# EAGLE design SOIC28-TSSOP28 v1.0 (EAGLE 7.2.0)
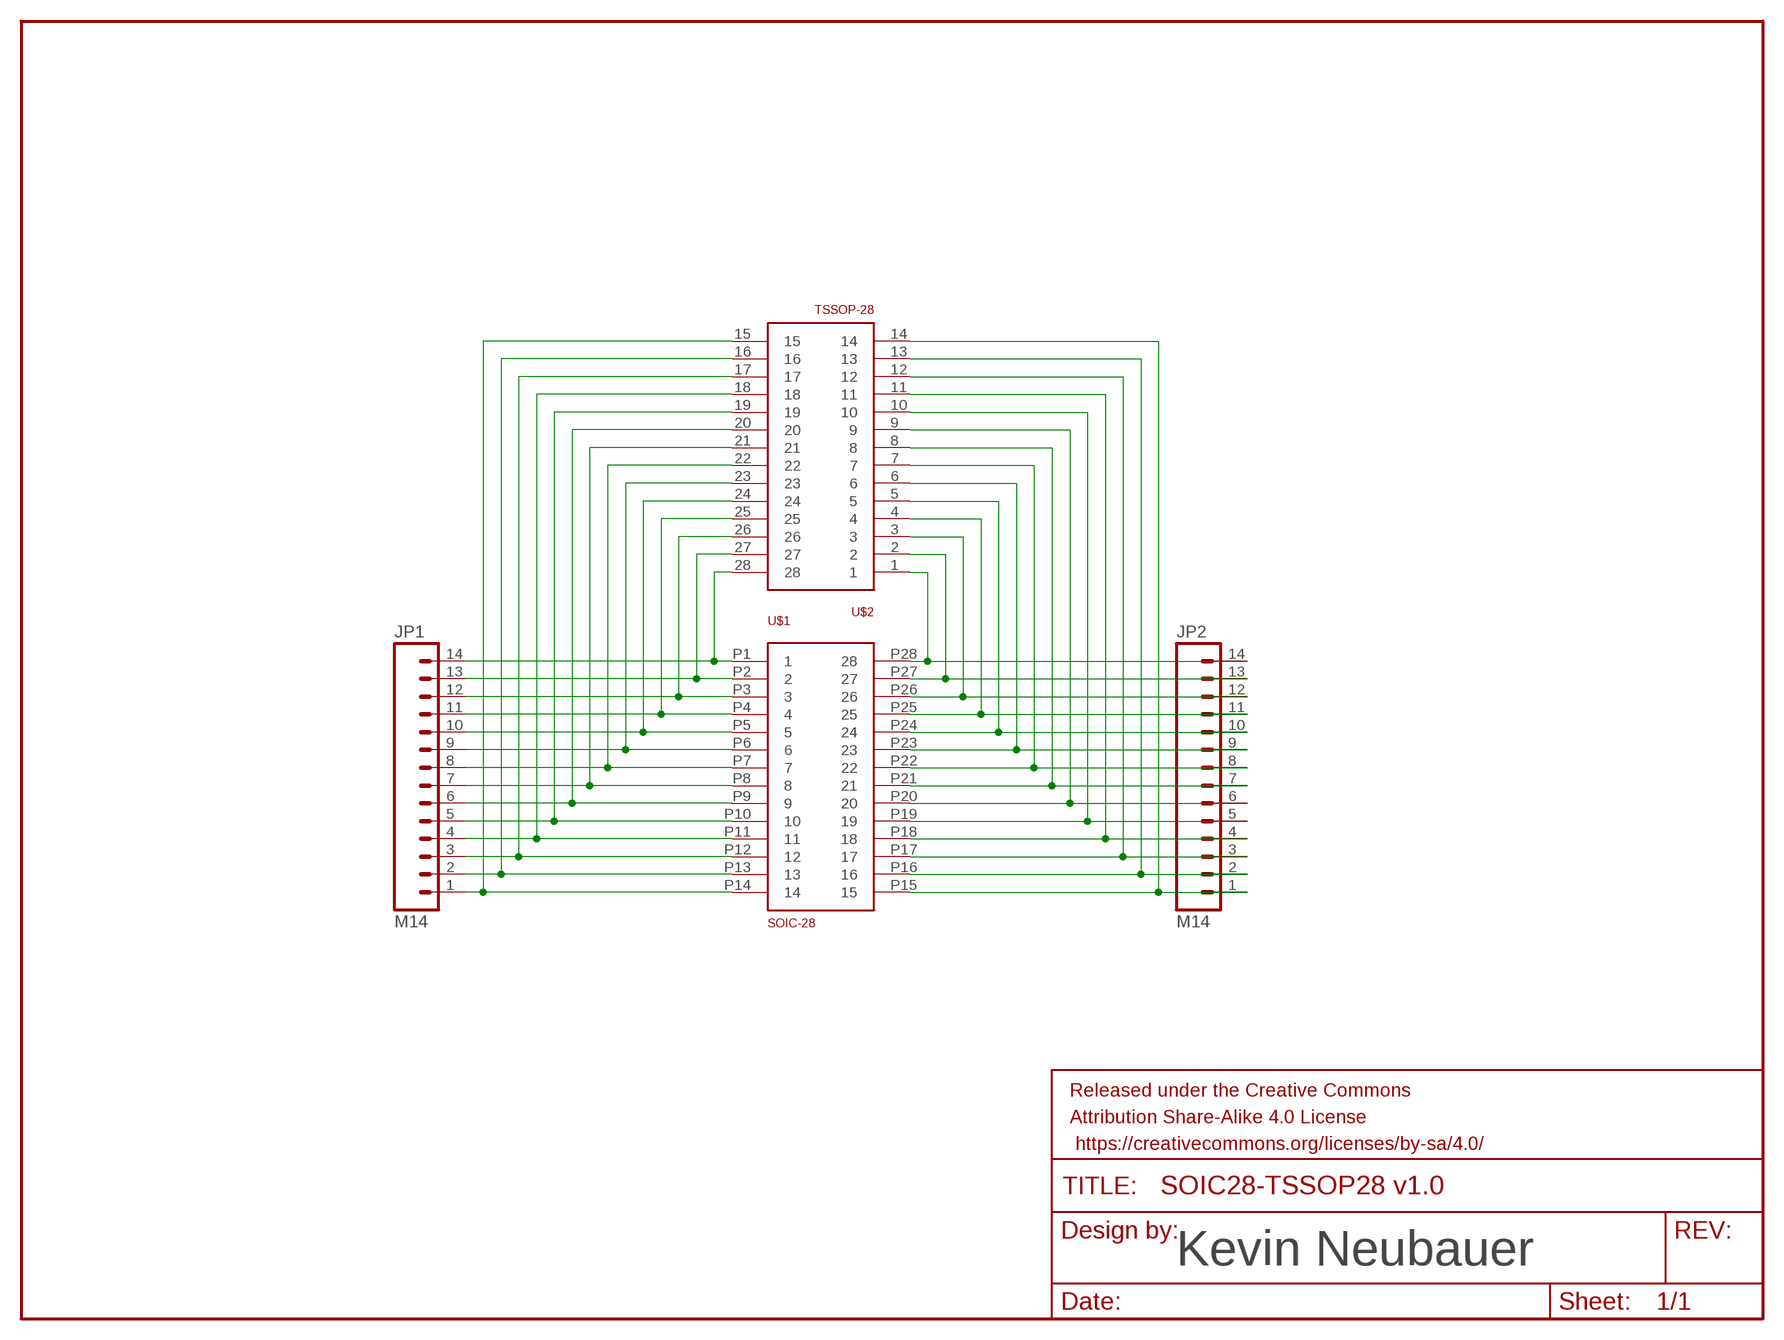
[diagram p0: schematic, sheet 1]

## Parts
FRAME1  FRAME-LETTER  [CREATIVE_COMMONS]
JP1  M14  [1X14]
JP2  M14  [1X14]
U$1  SOIC-28  [SOIC-28]
U$2  TSSOP-28  [TSSOP28]

## Nets
N$1: JP1.14 U$1.P1 U$2.28
N$2: JP1.13 U$1.P2 U$2.27
N$11: JP2.14 U$1.P28 U$2.1
N$12: JP2.13 U$1.P27 U$2.2
N$13: JP2.12 U$1.P26 U$2.3
N$14: JP2.11 U$1.P25 U$2.4
N$15: JP2.10 U$1.P24 U$2.5
N$16: JP2.9 U$1.P23 U$2.6
N$17: JP2.8 U$1.P22 U$2.7
N$18: JP2.7 U$1.P21 U$2.8
N$19: JP2.6 U$1.P20 U$2.9
N$20: JP2.5 U$1.P19 U$2.10
N$39: JP1.2 U$1.P13 U$2.16
N$40: JP1.1 U$1.P14 U$2.15
N$41: JP2.4 U$1.P18 U$2.11
N$42: JP2.3 U$1.P17 U$2.12
N$43: JP2.2 U$1.P16 U$2.13
N$44: JP2.1 U$1.P15 U$2.14
N$45: JP1.3 U$1.P12 U$2.17
N$46: JP1.4 U$1.P11 U$2.18
N$47: JP1.5 U$1.P10 U$2.19
N$48: JP1.6 U$1.P9 U$2.20
N$49: JP1.8 U$1.P7 U$2.22
N$50: JP1.7 U$1.P8 U$2.21
N$51: JP1.10 U$1.P5 U$2.24
N$52: JP1.9 U$1.P6 U$2.23
N$53: JP1.12 U$1.P3 U$2.26
N$54: JP1.11 U$1.P4 U$2.25

## Notes on the sheet
- Kevin Neubauer

## Library data of the parts
FRAME1 = SparkFun-Aesthetics:FRAME-LETTER: Schematic Frame Standard 8.5x11 US Letter frame
JP1 JP2 = SparkFun-Connectors:M14: Header 14 Standard 14-pin 0.1" header. Use with straight break away headers (SKU : PRT-00116), right angle break away headers (PRT-00553), swiss pins (PRT-00743), machine pins (PRT-00117), and female headers (PRT-00115).
U$1 = Kevin-GenericICFootprints:SOIC-28
U$2 = Kevin-GenericICFootprints:TSSOP-28

## Board
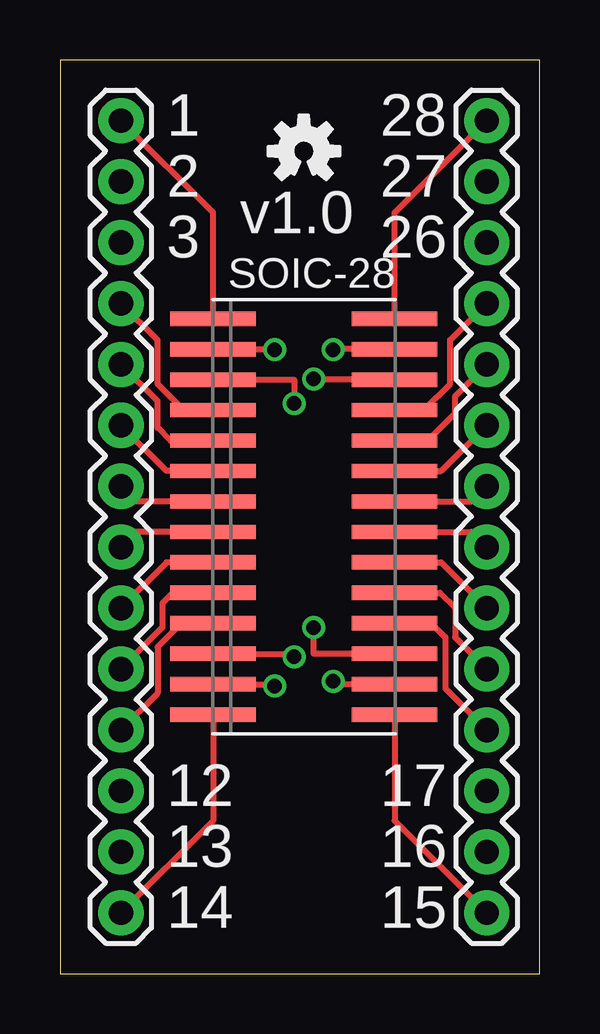
[diagram p1: board, top side]
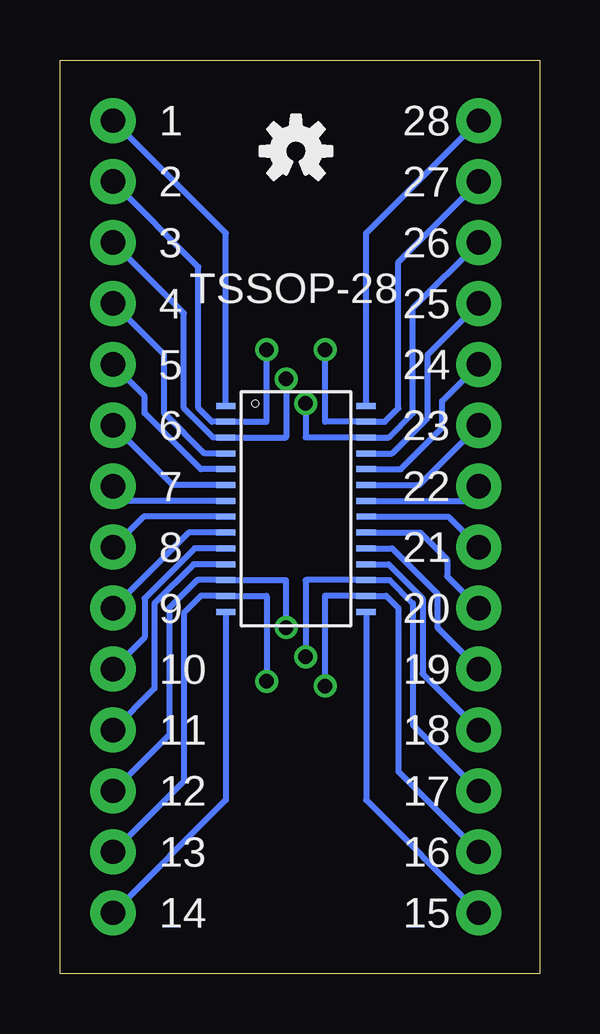
[diagram p2: board, bottom side, seen from below]

Size 19.99 x 38.09 mm. Coordinates in mm from the lower left corner, seen from the top.
Outline: 0,0 19.99,0 19.99,38.09 0,38.09 0,0
Copper layers (1*16): Top 0.0356mm / dielectric 1.5011mm / Bottom 0.0356mm
Design rules "OSH Park": minimum track width 6mil, minimum drill 13mil, track to track 6mil, track to pad 6mil, pad to pad 6mil, via to via 6mil, smd to smd 6mil, copper to edge 15mil, drill to drill 6mil, minimum pad ring 7mil, minimum via ring 7mil, stop-mask expansion 3mil, vias tented up to drill 0mil, thermal gap 10mil

### Footprints (pad centres in the part's own frame; a part is rotated, then mirrored left to right if it is on the bottom)
1X14 = drill 1.016 pad 1.88: 1 0,0; 2 2.54,0; 3 5.08,0; 4 7.62,0; 5 10.16,0; 6 12.7,0; 7 15.24,0; 8 17.78,0; 9 20.32,0; 10 22.86,0; 11 25.4,0; 12 27.94,0; 13 30.48,0; 14 33.02,0
SOIC-28 = smd 0.6 x 3.56: P1 -8.255,-3.78; P2 -6.985,-3.78; P3 -5.715,-3.78; P4 -4.445,-3.78; P5 -3.175,-3.78; P6 -1.905,-3.78; P7 -0.635,-3.78; P8 0.635,-3.78; P9 1.905,-3.78; P10 3.175,-3.78; P11 4.445,-3.78; P12 5.715,-3.78; P13 6.985,-3.78; P14 8.255,-3.78; P15 8.255,3.78; P16 6.985,3.78; P17 5.715,3.78; P18 4.445,3.78; P19 3.175,3.78; P20 1.905,3.78; P21 0.635,3.78; P22 -0.635,3.78; P23 -1.905,3.78; P24 -3.175,3.78; P25 -4.445,3.78; P26 -5.715,3.78; P27 -6.985,3.78; P28 -8.255,3.78
TSSOP28 = smd 0.8 x 0.25: 1 -2.921,4.623; 2 -2.921,3.962; 3 -2.921,3.302; 4 -2.921,2.642; 5 -2.921,1.981; 6 -2.921,1.321; 7 -2.921,0.66; 8 -2.927,0; 9 -2.921,-0.66; 10 -2.921,-1.321; 11 -2.921,-1.981; 12 -2.921,-2.642; 13 -2.921,-3.302; 14 -2.921,-3.962; 15 2.921,-3.962; 16 2.921,-3.302; 17 2.921,-2.642; 18 2.921,-1.981; 19 2.921,-1.321; 20 2.921,-0.66; 21 2.927,0; 22 2.921,0.66; 23 2.921,1.321; 24 2.921,1.981; 25 2.921,2.642; 26 2.921,3.302; 27 2.921,3.962; 28 2.921,4.623

### Placement (x,y rotation side)
FRAME1  -8.89,-10.16 0 top  (outside the outline)
JP1  2.54,2.54 90 top
JP2  17.78,2.54 90 top
U$1  10.16,19.05 270 top
U$2  10.16,19.05 0 bottom
U$3  [OSHW-LOGO-S]  10.16,34.29 0 bottom
U$4  [OSHW-LOGO-S]  10.16,34.29 0 top

### Tracks (layer width: path | path; a pad name or v marks a point on that pad's centre or on a via)
N$1
  Top 0.254: U$1.P1 6.38,31.72 JP1.14
  Bottom 0.254: U$2.28 7.24,30.86 JP1.14
N$2  (via drill 0.6)
  Top 0.254: U$1.P2 8.91,26.04 v8.94,26.01
  Bottom 0.254: JP1.13 5.89,29.67 5.89,23.57 6.45,23.01 U$2.27 8.94,23.01 v8.94,26.01
N$11
  Top 0.254: U$1.P28 13.94,31.72 JP2.14
  Bottom 0.254: U$2.1 13.08,30.86 JP2.14
N$12  (via drill 0.6)
  Top 0.254: U$1.P27 11.58,26.04 v11.38,26.01
  Bottom 0.254: JP2.13 14.22,29.46 14.22,23.57 13.66,23.01 U$2.2 11.38,23.01 v11.38,26.01
N$13  (via drill 0.6)
  Top 0.254: U$1.P26 10.77,24.77 v10.57,24.79
  Bottom 0.254: JP2.12 14.83,27.53 14.83,23.57 13.61,22.35 U$2.3 10.57,22.35 v10.57,24.79
N$14
  Top 0.254: U$1.P25 15.16,23.5 16.26,24.59 16.26,26.42 JP2.11
  Bottom 0.254: U$2.4 13.97,21.69 15.65,23.37 15.65,25.81 JP2.11
N$15
  Top 0.254: U$1.P24 15.32,22.23 16.46,23.37 16.46,24.08 JP2.10
  Bottom 0.254: U$2.5 14.12,21.03 16.46,23.37 16.46,24.08 JP2.10
N$16
  Top 0.254: U$1.P23 15.88,20.95 JP2.9
  Bottom 0.254: U$2.6 15.29,20.37 JP2.9
N$17
  Top 0.254: U$1.P22 17.14,19.68 JP2.8
  Bottom 0.254: U$2.7 17.17,19.71 JP2.8
N$18
  Top 0.254: U$1.P21 17.14,18.41 JP2.7
  Bottom 0.254: U$2.8 16.51,19.05 JP2.7
N$19
  Top 0.254: U$1.P20 15.88,17.14 JP2.6
  Bottom 0.254: U$2.9 14.63,18.39 JP2.6
N$20
  Top 0.254: U$1.P19 15.82,15.88 16.46,15.24 16.46,14.02 JP2.5
  Bottom 0.254: U$2.10 14.38,17.73 16.46,15.65 16.46,14.02 JP2.5
N$39  (via drill 0.6)
  Top 0.254: U$1.P13 8.94,12.06 v8.94,11.99
  Bottom 0.254: JP1.2 5.89,8.43 5.89,15.24 6.4,15.75 U$2.16 8.94,15.75 v8.94,11.99
N$40
  Top 0.254: U$1.P14 6.38,6.38 JP1.1
  Bottom 0.254: U$2.15 7.24,7.24 JP1.1
N$41
  Top 0.254: U$1.P18 15.47,14.61 16.05,14.02 16.05,11.89 JP2.4
  Bottom 0.254: U$2.11 14.43,17.07 16.05,15.44 16.05,11.89 JP2.4
N$42  (via drill 0.6)
  Top 0.254: U$1.P17 10.57,13.34 v10.57,14.43
  Bottom 0.254: JP2.3 15.44,9.96 15.44,15.24 14.28,16.41 U$2.12 10.57,16.41 v10.57,14.43
N$43  (via drill 0.6)
  Top 0.254: U$1.P16 11.38,12.06 v11.38,12.19
  Bottom 0.254: JP2.2 14.83,8.03 14.83,15.04 14.12,15.75 U$2.13 11.38,15.75 v11.38,12.19
N$44
  Top 0.254: U$1.P15 13.94,6.38 JP2.1
  Bottom 0.254: U$2.14 13.08,7.24 JP2.1
N$45  (via drill 0.6)
  Top 0.254: U$1.P12 9.75,13.34 v9.75,13.21
  Bottom 0.254: JP1.3 5.28,10.36 5.28,15.44 6.25,16.41 U$2.17 9.75,16.41 v9.75,13.21
N$46
  Top 0.254: U$1.P11 5.05,14.61 4.06,13.61 4.06,11.68 JP1.4
  Bottom 0.254: U$2.18 6.3,17.07 4.88,15.65 4.88,12.5 JP1.4
N$47
  Top 0.254: U$1.P10 4.7,15.88 4.27,15.44 4.27,14.43 JP1.5
  Bottom 0.254: U$2.19 6.15,17.73 4.27,15.85 4.27,14.43 JP1.5
N$48
  Top 0.254: U$1.P9 4.45,17.14 JP1.6
  Bottom 0.254: U$2.20 4.98,18.39 3.86,17.27 3.86,16.56 JP1.6
N$49
  Top 0.254: U$1.P7 3.17,19.68 JP1.8
  Bottom 0.254: U$2.22 3.15,19.71 JP1.8
N$50
  Top 0.254: U$1.P8 3.17,18.41 JP1.7
  Bottom 0.254: U$2.21 3.81,19.05 JP1.7
N$51
  Top 0.254: U$1.P5 4.6,22.23 4.06,22.76 4.06,23.88 JP1.10
  Bottom 0.254: U$2.24 5.79,21.03 4.06,22.76 4.06,23.88 JP1.10
N$52
  Top 0.254: U$1.P6 4.45,20.95 JP1.9
  Bottom 0.254: U$2.23 5.03,20.37 JP1.9
N$53  (via drill 0.6)
  Top 0.254: U$1.P3 9.75,24.77 v9.75,23.77
  Bottom 0.254: JP1.12 5.28,27.74 5.28,23.37 6.3,22.35 U$2.26 9.75,22.35 v9.75,23.77
N$54
  Top 0.254: U$1.P4 5.16,23.5 4.06,24.59 4.06,26.42 JP1.11
  Bottom 0.254: U$2.25 6.15,21.69 4.67,23.16 4.67,25.81 JP1.11

### Text on the board
tPlace: v1.0 | SOIC-28
bPlace: TSSOP-28
tNames: 1 | 28 | 2 | 27 | 3 | 26 | 12 | 17 | 13 | 16 | 14 | 15
bNames: 28 | 1 | 27 | 2 | 26 | 3 | 25 | 4 | 24 | 5 | 23 | 6 | 22 | 7 | 21 | 8 | 20 | 9 | 19 | 10 | 18 | 11 | 17 | 12 | 16 | 13 | 15 | 14
tDocu: Kevin Neubauer